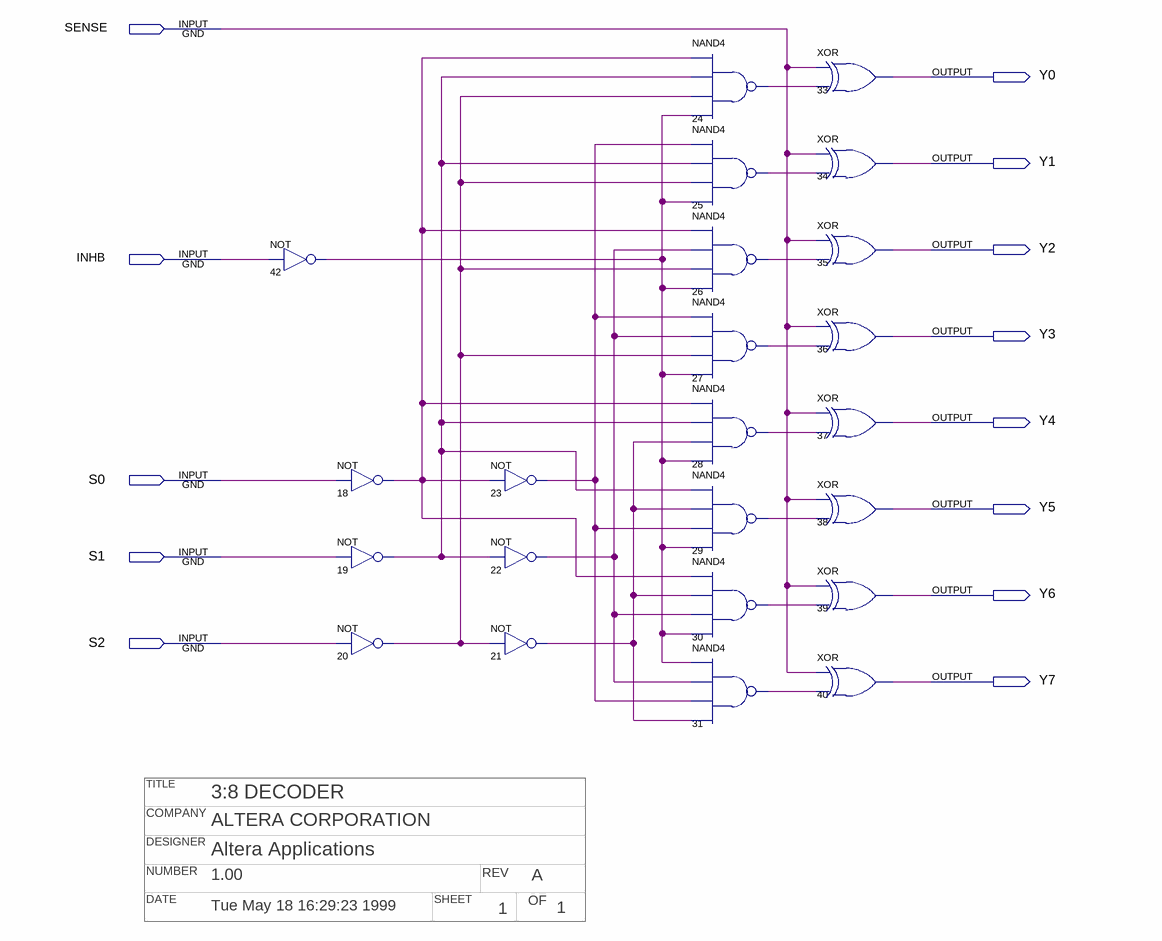
[diagram p0: schematic sheet]
// Quartus schematic dec38.bdf as structural Verilog: 23 symbols, 13 pins
// Title block: TITLE: 3:8 DECODER; COMPANY: ALTERA CORPORATION; DESIGNER: Altera Applications; NUMBER: 1.00; REV: A; DATE: Tue May 18 16:29:23 1999; SHEET: 1; OF: 1
module dec38 (
  input  SENSE,
  input  INHB,
  input  S0,
  input  S1,
  input  S2,
  output Y0,
  output Y1,
  output Y2,
  output Y3,
  output Y4,
  output Y5,
  output Y6,
  output Y7
);

  wire n18_out, n19_out, n20_out, n21_out, n22_out, n23_out, n24_out, n25_out, n26_out, n27_out, n28_out,
       n29_out, n30_out, n31_out, n42_out;

  not u_42 (n42_out, INHB);
  not u_18 (n18_out, S0);
  not u_19 (n19_out, S1);
  not u_20 (n20_out, S2);
  not u_23 (n23_out, n18_out);
  not u_22 (n22_out, n19_out);
  not u_21 (n21_out, n20_out);
  nand u_24 (n24_out, n18_out, n19_out, n20_out, n42_out);
  nand u_25 (n25_out, n23_out, n19_out, n20_out, n42_out);
  nand u_26 (n26_out, n18_out, n22_out, n20_out, n42_out);
  nand u_27 (n27_out, n23_out, n22_out, n20_out, n42_out);
  nand u_28 (n28_out, n18_out, n19_out, n21_out, n42_out);
  nand u_29 (n29_out, n19_out, n21_out, n23_out, n42_out);
  nand u_30 (n30_out, n18_out, n21_out, n22_out, n42_out);
  nand u_31 (n31_out, n42_out, n22_out, n23_out, n21_out);
  xor u_33 (Y0, SENSE, n24_out);
  xor u_34 (Y1, SENSE, n25_out);
  xor u_35 (Y2, SENSE, n26_out);
  xor u_36 (Y3, SENSE, n27_out);
  xor u_37 (Y4, SENSE, n28_out);
  xor u_38 (Y5, SENSE, n29_out);
  xor u_39 (Y6, SENSE, n30_out);
  xor u_40 (Y7, SENSE, n31_out);
endmodule
